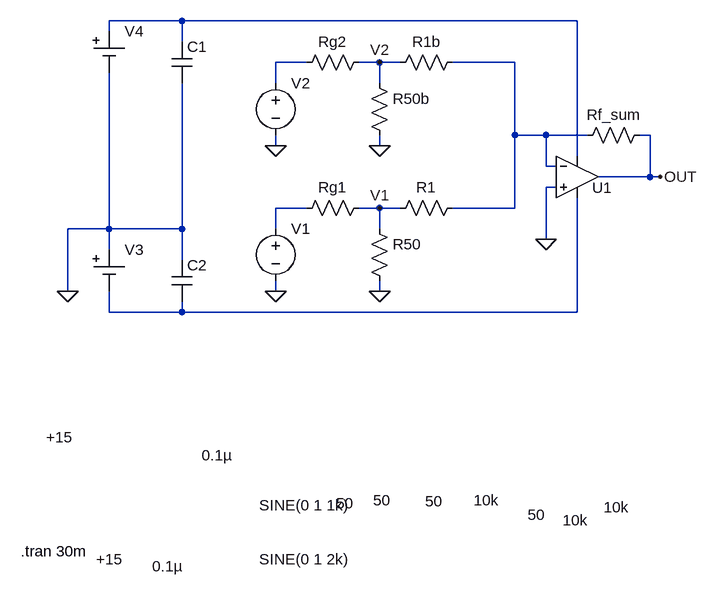
[diagram p0: schematic Circuito3_ac_time.asc]
Circuito3_ac_time.asc, the LTspice schematic file:
Version 4
SHEET 1 880 920
WIRE -160 64 -272 64
WIRE 448 64 -160 64
WIRE -272 80 -272 64
WIRE -160 96 -160 64
WIRE 32 128 -16 128
WIRE 144 128 112 128
WIRE 176 128 144 128
WIRE 352 128 256 128
WIRE -16 160 -16 128
WIRE 144 160 144 128
WIRE 352 240 352 128
WIRE 400 240 352 240
WIRE 464 240 400 240
WIRE 560 240 544 240
WIRE -16 256 -16 240
WIRE 144 256 144 240
WIRE 448 272 448 64
WIRE 400 288 400 240
WIRE 416 288 400 288
WIRE 560 304 560 240
WIRE 560 304 480 304
WIRE 576 304 560 304
WIRE 416 320 400 320
WIRE 32 352 -16 352
WIRE 144 352 112 352
WIRE 176 352 144 352
WIRE 352 352 352 240
WIRE 352 352 256 352
WIRE -272 384 -272 144
WIRE -272 384 -336 384
WIRE -160 384 -160 160
WIRE -160 384 -272 384
WIRE -16 384 -16 352
WIRE 144 384 144 352
WIRE 400 400 400 320
WIRE -272 416 -272 384
WIRE -160 432 -160 384
WIRE -336 480 -336 384
WIRE -16 480 -16 464
WIRE 144 480 144 464
WIRE -272 512 -272 480
WIRE -160 512 -160 496
WIRE -160 512 -272 512
WIRE 448 512 448 336
WIRE 448 512 -160 512
FLAG -16 256 0
FLAG 400 400 0
FLAG 144 256 0
FLAG -336 480 0
FLAG 144 128 V2
FLAG 576 304 OUT
FLAG -16 480 0
FLAG 144 480 0
FLAG 144 352 V1
SYMBOL cap -176 432 R0
WINDOW 3 46 300 Left 2
SYMATTR InstName C2
SYMATTR Value 0.1µ
SYMBOL Misc\\cell -272 416 R0
WINDOW 123 0 0 Left 0
WINDOW 39 0 0 Left 0
WINDOW 3 -97 289 Left 2
SYMATTR InstName V3
SYMATTR Value +15
SYMBOL Misc\\cell -272 80 R0
WINDOW 123 0 0 Left 0
WINDOW 39 0 0 Left 0
WINDOW 3 -20 812 Left 2
SYMATTR InstName V4
SYMATTR Value +15
SYMBOL res 128 112 R90
WINDOW 0 0 56 VBottom 2
WINDOW 3 679 37 VTop 2
SYMATTR InstName Rg2
SYMATTR Value 50
SYMBOL res 160 144 R270
WINDOW 0 32 56 VTop 2
WINDOW 3 -673 285 VBottom 2
SYMATTR InstName R1b
SYMATTR Value 10k
SYMBOL res 560 224 R90
WINDOW 0 0 56 VBottom 2
WINDOW 3 573 52 VTop 2
SYMATTR InstName Rf_sum
SYMATTR Value 10k
SYMBOL voltage -16 144 R0
WINDOW 3 -25 748 Left 2
WINDOW 123 0 0 Left 0
WINDOW 39 0 0 Left 0
SYMATTR Value SINE(0 1 2k)
SYMATTR InstName V2
SYMBOL res 128 144 R0
WINDOW 3 244 680 Left 2
SYMATTR InstName R50b
SYMATTR Value 50
SYMBOL cap -176 96 R0
WINDOW 3 -30 807 Left 2
SYMATTR InstName C1
SYMATTR Value 0.1µ
SYMBOL Opamps/UniversalOpamp2 448 304 R0
WINDOW 0 23 17 Left 2
SYMATTR InstName U1
SYMBOL res 128 336 R90
WINDOW 0 0 56 VBottom 2
WINDOW 3 450 -20 VTop 2
SYMATTR InstName Rg1
SYMATTR Value 50
SYMBOL res 160 368 R270
WINDOW 0 32 56 VTop 2
WINDOW 3 -418 148 VBottom 2
SYMATTR InstName R1
SYMATTR Value 10k
SYMBOL voltage -16 368 R0
WINDOW 3 -25 441 Left 2
WINDOW 123 0 0 Left 0
WINDOW 39 0 0 Left 0
SYMATTR Value SINE(0 1 1k)
SYMATTR InstName V1
SYMBOL res 128 368 R0
WINDOW 3 86 435 Left 2
SYMATTR InstName R50
SYMATTR Value 50
TEXT -408 880 Left 2 !.tran 30m

The netlist it stands for:
* Circuito3_ac_time.asc
C2 0 N005 0.1µ
V3 0 N005 +15
V4 N001 0 +15
Rg2 V2 N002 50
R1b V2 N003 10k
Rf_sum OUT N003 10k
V2 N002 0 SINE(0 1 2k)
R50b V2 0 50
C1 N001 0 0.1µ
XU1 0 N003 N001 N005 OUT level.2 Avol=1Meg GBW=10Meg Slew=10Meg ilimit=25m rail=0 Vos=0 phimargin=45 en=0 enk=0 in=0 ink=0 Rin=500Meg  ; pins IN+ IN- V+ V- OUT
Rg1 V1 N004 50
R1 V1 N003 10k
V1 N004 0 SINE(0 1 1k)
R50 V1 0 50
.tran 30m
.lib UniversalOpamps2.sub
.backanno
.end